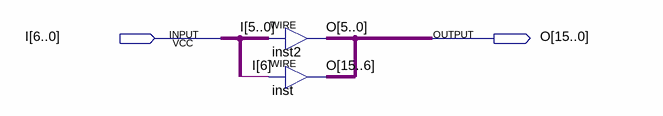
[diagram p0: schematic sheet]
// Quartus schematic SignExt7.bdf as structural Verilog: 2 symbols, 2 pins
module SignExt7 (
  input  [6:0] I,
  output [15:0] O
);

  assign O[5:0] = I[5:0];  // WIRE inst2
  assign O[15:6] = {10{I[6]}};  // WIRE inst
endmodule
